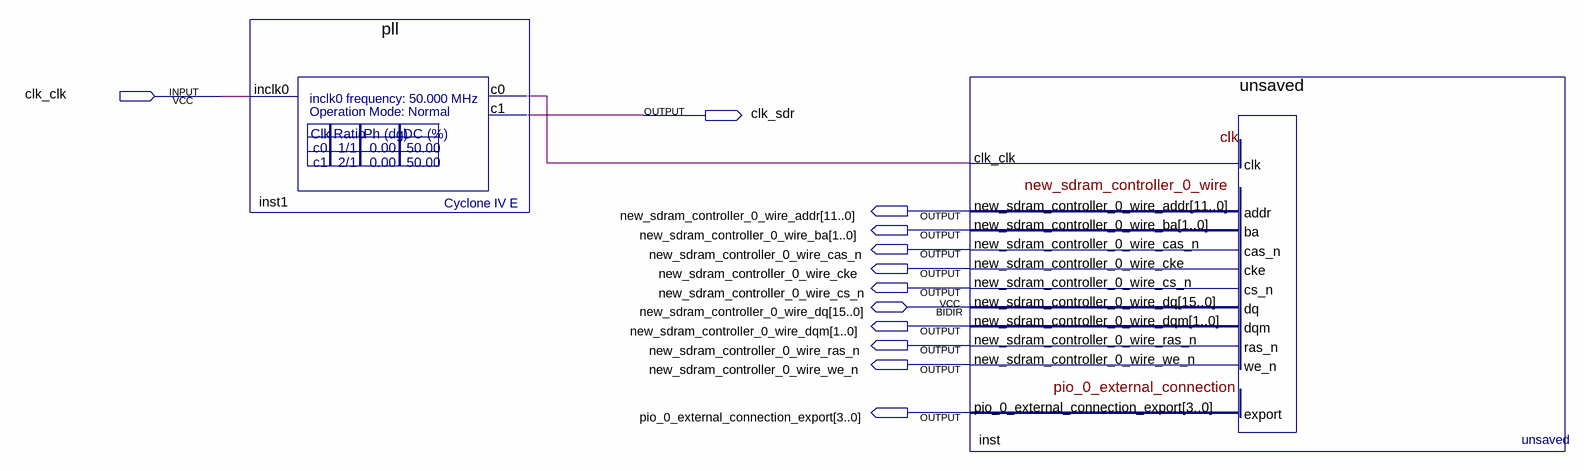
[diagram p0: schematic sheet]
// Quartus schematic niosdram.bdf as structural Verilog: 2 symbols, 12 pins
module niosdram (
  input  clk_clk,
  inout  [15:0] new_sdram_controller_0_wire_dq,
  output clk_sdr,
  output [11:0] new_sdram_controller_0_wire_addr,
  output [1:0] new_sdram_controller_0_wire_ba,
  output new_sdram_controller_0_wire_cas_n,
  output new_sdram_controller_0_wire_cke,
  output new_sdram_controller_0_wire_cs_n,
  output [1:0] new_sdram_controller_0_wire_dqm,
  output new_sdram_controller_0_wire_ras_n,
  output new_sdram_controller_0_wire_we_n,
  output [3:0] pio_0_external_connection_export
);

  wire inst1_c0;

  pll inst1 (.inclk0(clk_clk), .c0(inst1_c0), .c1(clk_sdr));
  unsaved inst (
    .clk_clk(inst1_c0), .new_sdram_controller_0_wire_addr(new_sdram_controller_0_wire_addr),
    .new_sdram_controller_0_wire_ba(new_sdram_controller_0_wire_ba),
    .new_sdram_controller_0_wire_cas_n(new_sdram_controller_0_wire_cas_n),
    .new_sdram_controller_0_wire_cke(new_sdram_controller_0_wire_cke),
    .new_sdram_controller_0_wire_cs_n(new_sdram_controller_0_wire_cs_n),
    .new_sdram_controller_0_wire_dqm(new_sdram_controller_0_wire_dqm),
    .new_sdram_controller_0_wire_ras_n(new_sdram_controller_0_wire_ras_n),
    .new_sdram_controller_0_wire_we_n(new_sdram_controller_0_wire_we_n),
    .pio_0_external_connection_export(pio_0_external_connection_export),
    .new_sdram_controller_0_wire_dq(new_sdram_controller_0_wire_dq));
endmodule
